# Altium schematic sheet SD.SchDoc
size 177 x 88 mm
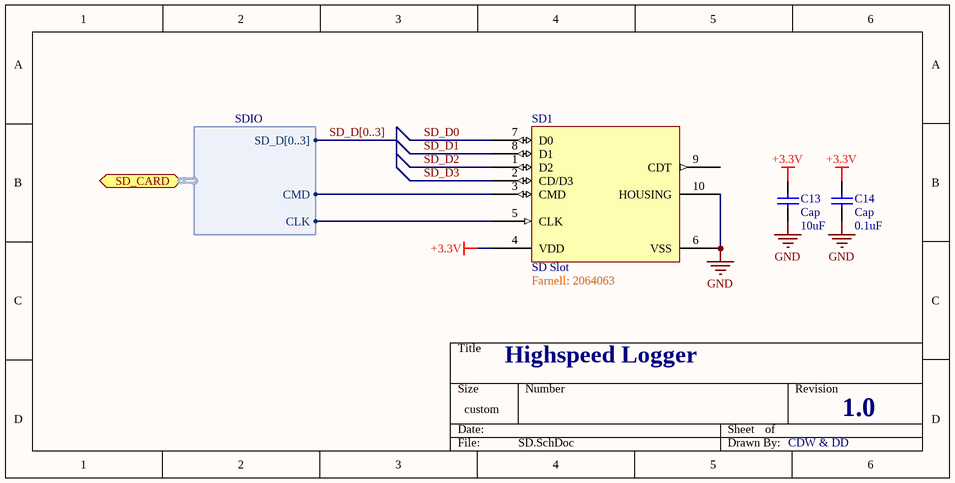
[diagram p0: SD.SchDoc]

## Parts
C13  Cap  value 10uF  [V0603]
C14  Cap  value 0.1uF  [V0402]
SD1  SD Slot  Farnell: 2064063  [MICROSD-card]

## Ports
SD_CARD (harness SDIO)

## Harnesses
SDIO: CLK, CMD, SD_D[0..3]

## Nets
+3.3V: C13.1 C14.1 SD1.4(VDD)
GND: C13.2 C14.2 SD1.6(VSS) SD1.10(HOUSING)
SD_D0: SD1.7(D0)
SD_D1: SD1.8(D1)
SD_D2: SD1.1(D2)
SD_D3: SD1.2(CD/D3)
NetSD1_3: SD1.3(CMD) ; port SD_CARD.CMD
NetSD1_5: SD1.5(CLK) ; port SD_CARD.CLK

Not connected (* = marked no-connect by the designer): SD1 9(CDT)

## Buses and harness runs
bus SD_D[0..3]

## Notes on the sheet
- Highspeed Logger
- 1.0
- CDW & DD

## Library data of the parts
C13 C14 = Cap: Capacitor; Published: 8-Jun-2000; LatestRevisionDate: 17-Jul-2002; LatestRevisionNote: Re-released for DXP Platform.; PackageReference: RAD-0.3; Publisher: Altium Limited; PackageDescription: Radial Cap, Thru-Hole; 2 Leads; 0.3 in Pin Spacing
SD1 = SD Slot: pin to pad: 1>DAT2 2>CD/DAT3 3>CMD 4>VCC 5>CLK 6>GND 7>DAT0 8>DAT1 9>CD 10>HOUSING